# EAGLE schematic M5StickSub (EAGLE 9.6.2)
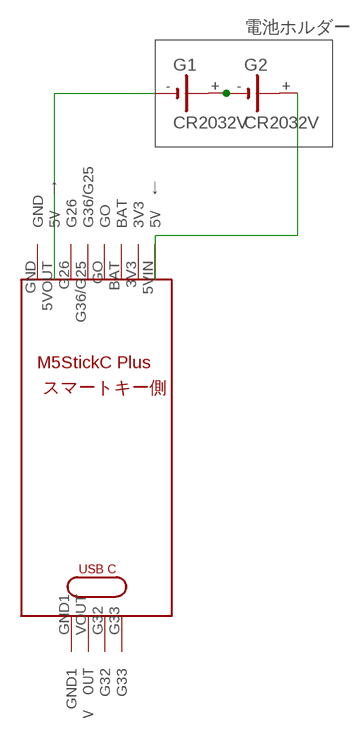
[diagram p0: schematic, sheet 1]

## Parts
G1  CR2032V  [CR2032V]
G2  CR2032V  [CR2032V]
U$1  M5STICKCPLUS  [M5STICK]

## Nets
N$1: G1.+ G2.-
N$2: G2.+ U$1.5VIN(5V　←)
N$3: G1.- U$1.5VOUT(5V　→)
Unconnected: G1.+@1(+) G2.+@1(+) U$1.3V3 U$1.BAT U$1.G26 U$1.G32 U$1.G33 U$1.G36/G25 U$1.GND U$1.GND1 U$1.GO U$1.VOUT(V　OUT)

## Notes on the sheet
- 電池ホルダー
- M5StickC Plus
- スマートキー側

## Library data of the parts
G1 G2 = battery:CR2032V: LI BATTERY Varta
U$1 = M5stickcPlus:M5STICKCPLUS